# Altium schematic sheet CurrentSensingSM.SchDoc
size A; SheetNumber: 7; SheetTotal: 7
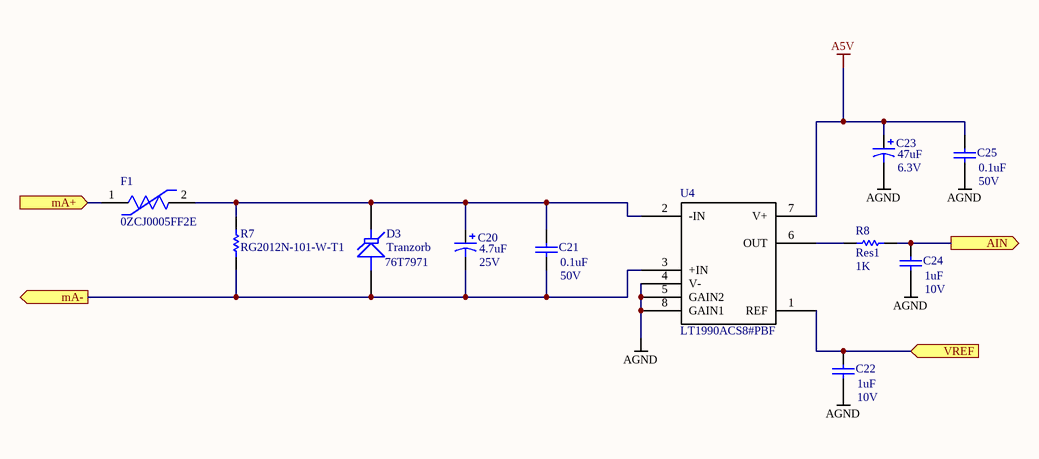
[diagram p0: CurrentSensingSM.SchDoc]

## Parts
C20  value 4.7uF  Voltage Rating: 25V  [RB7.6-15]  (hidden comment: Cap Pol1)
C21  value 0.1uF  Voltage Rating: 50V  [RAD-0.3]  (hidden comment: Cap)
C22  value 1uF  Voltage Rating: 10V  [RAD-0.3]  (hidden comment: Cap)
C23  value 47uF  Voltage Rating: 6.3V  [RB7.6-15]  (hidden comment: Cap Pol1)
C24  value 1uF  Voltage Rating: 10V  [RAD-0.3]  (hidden comment: Cap)
C25  value 0.1uF  Voltage Rating: 50V  [RAD-0.3]  (hidden comment: Cap)
D3  Tranzorb  Supplier Part Number 1: 76T7971  [SZ1SMB36CAT3G]
F1  0ZCJ0005FF2E  [FP-0ZCJ0005FF2E-MFG]
R7  RG2012N-101-W-T1  [RESC2013X50X40ML20T20]
R8  Res1  value 1K  [AXIAL-0.3]
U4  LT1990ACS8#PBF  [LT1990ACS8-PBF]

## Ports
AIN (out), mA+ (in), mA- (out), VREF (in)

## Nets
A5V: C23.1 C25.2 U4.7(V+)
AGND: C22.1 C23.2 C24.1 C25.1 U4.4(V-) U4.5(GAIN2) U4.8(GAIN1)
AIN: C24.2 R8.2 ; port AIN
mA+: F1.1 ; port mA+
mA-: C20.2 C21.1 D3.1(A) R7.1 U4.3(+IN) ; port mA-
VREF: C22.2 U4.1(REF) ; port VREF
NetC20_1: C20.1 C21.2 D3.2(K) F1.2 R7.2 U4.2(-IN)
NetR8_1: R8.1 U4.6(OUT)

## Library data of the parts
C20 C23 = Cap Pol1: Polarized Capacitor (Radial); Published: 8-Jun-2000; LatestRevisionDate: 17-Jul-2002; LatestRevisionNote: Re-released for DXP Platform.; PackageReference: RB7.6-15; Publisher: Altium Limited; PackageDescription: Polarized Capacitor (Radial); 2 Leads
C21 C22 C24 C25 = Cap: Capacitor; Published: 8-Jun-2000; LatestRevisionDate: 17-Jul-2002; LatestRevisionNote: Re-released for DXP Platform.; PackageReference: RAD-0.3; Publisher: Altium Limited; PackageDescription: Radial Cap, Thru-Hole; 2 Leads; 0.3 in Pin Spacing
D3 = Tranzorb: 1SMB Series 600 W 36 V Bi-Directional Surface Mount TVS Diode - DO-214AA; Manufacturer: ON Semiconductor; Direction: Bidirectional; Reverse Breakdown Voltage: 40V; Number of Bidirectional Channels: 1; Reverse Standoff Voltage: 36V; Clamping Voltage: 58.1V; Peak Pulse Power: 600W; Power Line Protection: No; Peak Pulse Current: 10.3A; Test Current: 1mA; ESD Protection: Yes; Max Reverse Leakage Current: 5uA; Element Configuration: Single; Diode Type: ZENER; Published: 24-Mar-1999; LatestRevisionDate: 17-Jul-2002; LatestRevisionNote: Re-released for DXP Platform.; PackageReference: DO-7; Publisher: Altium Limited; PackageDescription: Axial Lead Diode; Supplier 1: Newark; Manufacturer Part Number: SZ1SMB36CAT3G; RoHS: Yes; Category: TVS Diodes; Mount: Surface Mount; Case/Package: SMB; Number of Pins: 2; Min Operating Temperature: -65°C; Max Operating Temperature: 150°C; Packaging: Tape and Reel; Package Quantity: 2500; Min Breakdown Voltage: 40V; Polarity: Bidirectional; Number of Elements: 1; Max Power Dissipation: 600W; Leakage Current: 5uA; Breakdown Voltage: 40V; Resistor Type: Zener; Series: Automotive, AEC-Q101; Length: 4.57mm; Width: 3.81mm; Height: 2.41mm; RoHS Compliant: Yes; Lead Free: Lead Free; ComponentLink1URL: https://datasheet.ciiva.com/11313/1smb10cat3-d-11313549.pdf?src-supplier=Avnet; ComponentLink1Description: https://datasheet.ciiva.com/11313/1smb10cat3-d-11313549.pdf?src-supplier=Avnet; ComponentLink2URL: https://datasheet.ciiva.com/354/1smb10cat3-d-354502.pdf?src-supplier=Digi-Key; ComponentLink2Description: https://datasheet.ciiva.com/354/1smb10cat3-d-354502.pdf?src-supplier=Digi-Key
F1 = CMP-16043-000008-1: PTC RESET FUSE 60V 50MA 1206; Time to Trip: 1.5s; Max Current Rating: 10A; Number of Terminals/Pins: 2; Trip Current: 150mA; Power Dissipation: 400mW; Approvals: UL; Contact Plating: Tin; Hold Current: 50mA; Max Voltage Rating (DC): 60V; Packaging: Tape and Reel; Case/Package: 1206; Case Code (Imperial): 1206; Package Quantity: 1; Mount: Surface Mount; Min Operating Temperature: -40°C; Max Operating Temperature: 85°C; Case Code (Metric): 3216; RoHS Compliant: Yes; Lead Free: Lead Free
R7 = CMP-2001-04796-1: Manufacturer: Susumu; Value: 100; Part Number: RG2012N-101-W-T1
R8 = Res1: Resistor; Published: 8-Jun-2000; LatestRevisionDate: 17-Jul-2002; LatestRevisionNote: Re-released for DXP Platform.; PackageReference: AXIAL-0.3; Publisher: Altium Limited; PackageDescription: Axial Device, Thru-Hole; 2 Leads; 0.3 in Pin Spacing